# Altium schematic sheet Power.SchDoc
size A4; SheetNumber: 3; SheetTotal: 8
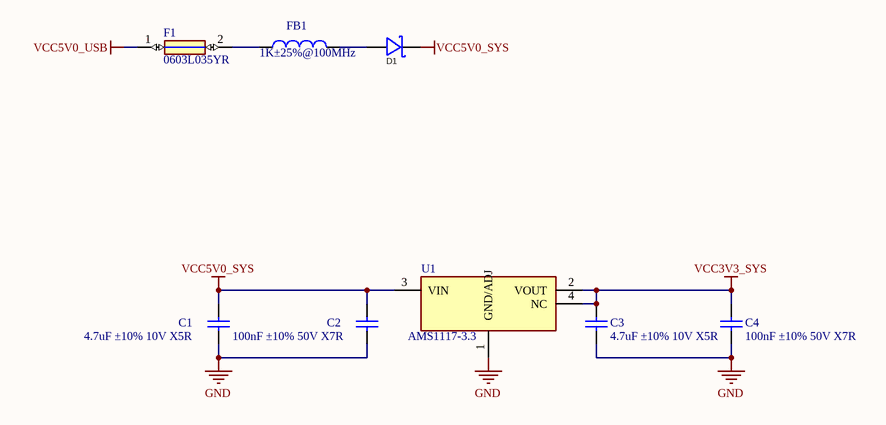
[diagram p0: Power.SchDoc]

## Parts
C1  4.7uF ±10% 10V X5R  [C0402]
C2  100nF ±10% 50V X7R  [C0402]
C3  4.7uF ±10% 10V X5R  [C0402]
C4  100nF ±10% 50V X7R  [C0402]
D1  B340A-13-F  [SMA_L4.4-W2.6-LS5.0-RD]  (value not drawn)
F1  0603L035YR  [FUSC1608X75N]
FB1  1K±25%@100MHz  [BLM18SP221SN1B]
U1  AMS1117-3.3  [SOT-223-4_L6.5-W3.5-P2.30-LS7.0-BR]

## Nets
GND: C1.1 C2.1 C3.1 C4.1 U1.1(GND/ADJ)
VCC3V3_SYS: C3.2 C4.2 U1.2(VOUT) U1.4(NC)
VCC5V0_SYS: C1.2 C2.2 D1.1(K) U1.3(VIN)
VCC5V0_USB: F1.1
NetD1_2: D1.2(A) FB1.2
NetF1_2: F1.2 FB1.1

## Library data of the parts
C1 C3 = Cap: CL05A475KP5NRNC; Published: 8-Jun-2000; LatestRevisionDate: 17-Jul-2002; LatestRevisionNote: Re-released for DXP Platform.; PackageReference: RAD-0.3; Publisher: Altium Limited; PackageDescription: Radial Cap, Thru-Hole; 2 Leads; 0.3 in Pin Spacing
C2 C4 = Cap: CL05B104KO5NNNC; Published: 8-Jun-2000; LatestRevisionDate: 17-Jul-2002; LatestRevisionNote: Re-released for DXP Platform.; PackageReference: RAD-0.3; Publisher: Altium Limited; PackageDescription: Radial Cap, Thru-Hole; 2 Leads; 0.3 in Pin Spacing
D1 = Diode_Schottky: 直流反向耐压(Vr):40V;平均整流电流(Io):3A;正向压降(Vf):500mV@3A;; Manufacturer: DIODES(美台); Add into BOM: yes; Reverse Voltage (Vr): 40V; Average Rectified Current (Io): 3A; Name: B340A-13-F; Symbol: B340A-13-F; Device: B340A-13-F; LCSC Part Name: 40V 3A 500mV@3A; Supplier Part: C85098; Manufacturer Part: B340A-13-F; Supplier Footprint: SMA(DO-214AC); JLCPCB Part Class: 扩展库; Datasheet: https://atta.szlcsc.com/upload/public/pdf/source/20171023/C134454_15087453575121052549.pdf; Supplier: LCSC; Convert to PCB: yes; Forward Voltage (Vf@If): 500mV@3A
F1 = 0603L035YR: Fuse; Manufacturer_Name: LITTELFUSE; Datasheet Link: https://www.littelfuse.com/~/media/electronics/datasheets/resettable_ptcs/littelfuse_ptc_0603l_datasheet.pdf.pdf; Height: 0.75mm; Manufacturer_Part_Number: 0603L035YR; Mouser Part Number: 576-0603L035YR; Mouser Price/Stock: https://www.mouser.co.uk/ProductDetail/Littelfuse/0603L035YR?qs=PalBzRKzfnvD8ztzU42n%2Fw%3D%3D; Arrow Part Number: 0603L035YR; Arrow Price/Stock: https://www.arrow.com/en/products/0603l035yr/littelfuse?region=europe
FB1 = Inductor: BLM21AG102SN1D; Code_IEC: 1005; Value: 10uH; Published: 8-Jun-2000; LatestRevisionDate: 29-May-2009; LatestRevisionNote: IPC-7351 Footprint Added.; PackageReference: 0402-A; Publisher: Altium Limited; PackageDescription: Chip Inductor; Code_JEITA: 0402
U1 = AMS1117-3.3: Integrated Circuit; Manufacturer_Name: Advanced; Datasheet Link: https://datasheet.datasheetarchive.com/originals/distributors/Datasheets-28/DSA-550594.pdf; Height: 1.8mm; Manufacturer_Part_Number: AMS1117-3.3